# EAGLE schematic LMP2011basedV2 (EAGLE 8.5.1)
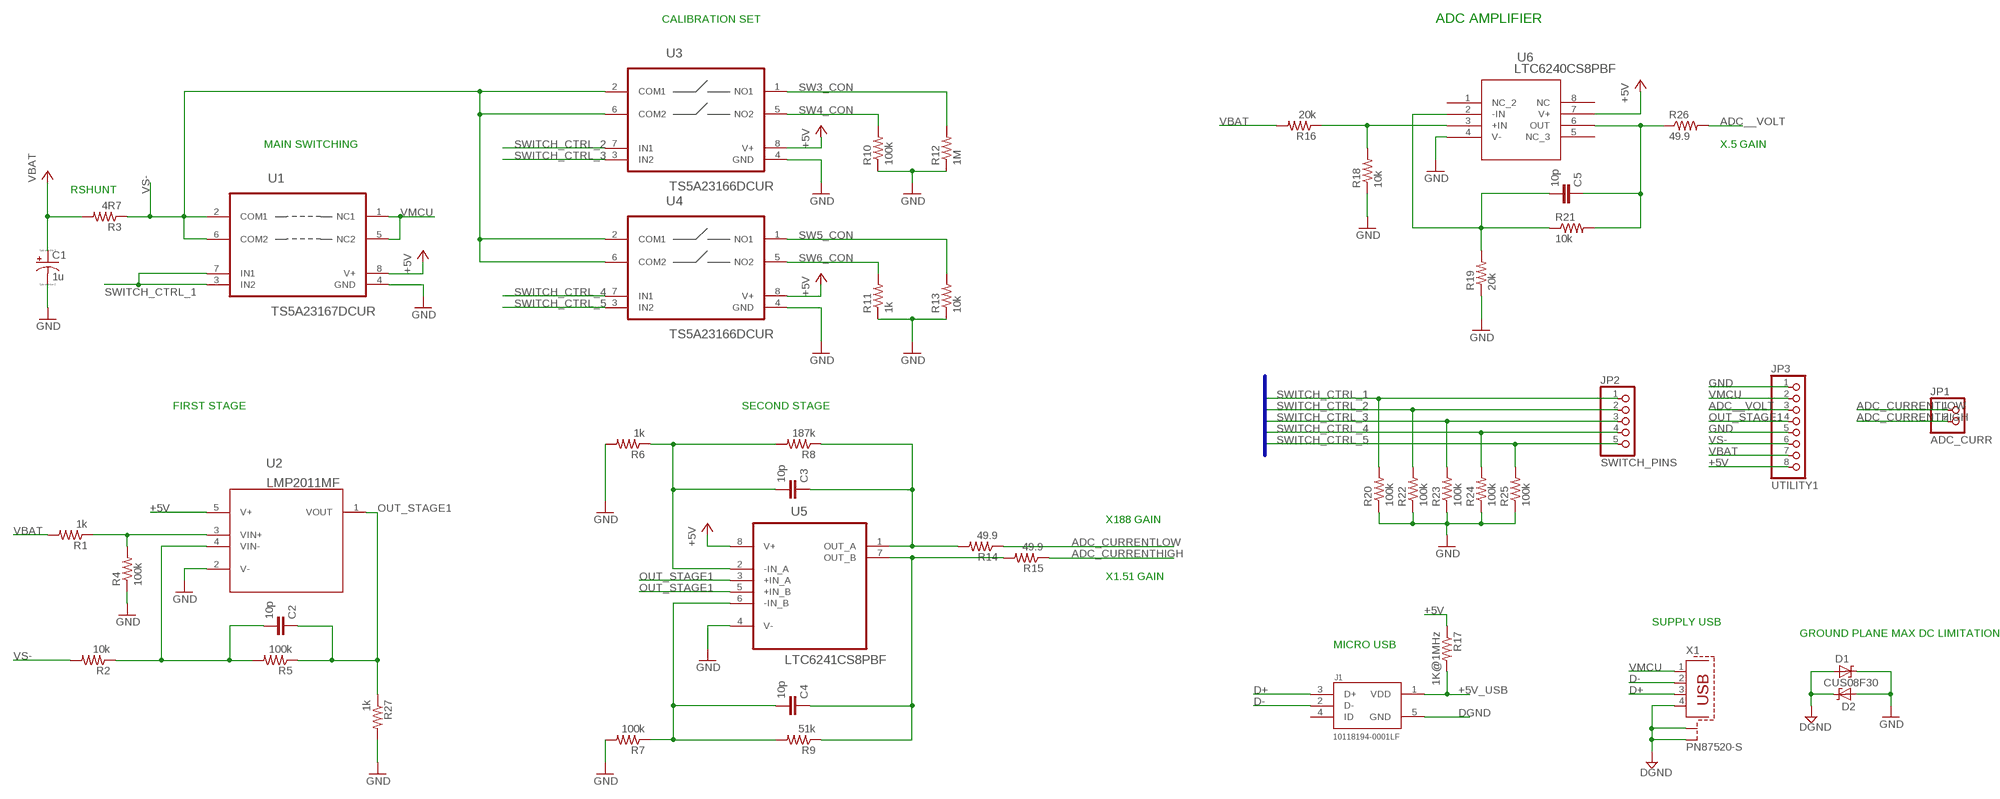
[diagram p0: schematic, sheet 1]

## Parts
C1  1u  CPOL-USB  [PANASONIC_B]
C2  10p  C-EUC0805  [C0805]
C3  10p  C-EUC0805  [C0805]
C4  10p  C-EUC0805  [C0805]
C5  10p  C-EUC0805  [C0805]
D1  CUS08F30  [SOD323]
D2  CUS08F30  [SOD323]
J1  10118194-0001LF  [FRAMATOME_10118194-0001LF]
JP1  ADC_CURR  PINHD-1X2  [1X02]
JP2  SWITCH_PINS  PINHD-1X5  [1X05]
JP3  UTILITY1  PINHD-1X8  [1X08]
R1  1k  R-US_R0805  [R0805]
R2  10k  R-US_R0805  [R0805]
R3  4R7  R-US_R0805  [R0805]
R4  100k  R-US_R0805  [R0805]
R5  100k  R-US_R0805  [R0805]
R6  1k  R-US_R0805  [R0805]
R7  100k  R-US_R0805  [R0805]
R8  187k  R-US_R0805  [R0805]
R9  51k  R-US_R0805  [R0805]
R10  100k  R-US_R0805  [R0805]
R11  1k  R-US_R0805  [R0805]
R12  1M  R-US_R0805  [R0805]
R13  10k  R-US_R0805  [R0805]
R14  49.9  R-US_R0805  [R0805]
R15  49.9  R-US_R0805  [R0805]
R16  20k  R-US_R0805  [R0805]
R17  1K@1MHz  R-US_R0805  [R0805]
R18  10k  R-US_R0805  [R0805]
R19  20k  R-US_R0805  [R0805]
R20  100k  R-US_R0805  [R0805]
R21  10k  R-US_R0805  [R0805]
R22  100k  R-US_R0805  [R0805]
R23  100k  R-US_R0805  [R0805]
R24  100k  R-US_R0805  [R0805]
R25  100k  R-US_R0805  [R0805]
R26  49.9  R-US_R0603  [R0603]
R27  1k  R-US_R0805  [R0805]
U1  TS5A23167DCUR  [SOP50P310X90-8N]
U2  LMP2011MF  [SOT95P285X120-5N]
U3  TS5A23166DCUR  [SOP50P310X90-8N]
U4  TS5A23166DCUR  [SOP50P310X90-8N]
U5  LTC6241CS8PBF  [SOIC127P600X175-8N]
U6  LTC6240CS8PBF  [SO-8_S]
X1  PN87520-S  [PN87520-S]

## Nets
+5V: JP3.8 R17.1 U1.8(V+) U2.5(V+) U3.8(V+) U4.8(V+) U5.8(V+) U6.7(V+)
+5V_USB: J1.1(VDD) R17.2
ADC__VOLT: JP3.3 R26.2
ADC_CURRENTHIGH: JP1.2 R15.1
ADC_CURRENTLOW: JP1.1 R14.1
D+: J1.3(D+) X1.3
D-: J1.2(D-) X1.2
DGND: D1.A D2.C J1.5(GND) X1.4 X1.S1 X1.S2
GND: C1.- D1.C D2.A JP3.1 JP3.5 R4.1 R6.2 R7.2 R10.1 R11.1 R12.1 R13.1 R18.1 R19.1 R20.1 R22.1 R23.1 R24.1 R25.1 R27.2 U1.4(GND) U2.2(V-) U3.4(GND) U4.4(GND) U5.4(V-) U6.4(V-)
N$1: R16.1 R18.2 U6.3(+IN)
N$2: C5.1 R21.2 R26.1 U6.6(OUT)
N$4: C5.2 R19.2 R21.1 U6.2(-IN)
N$7: C3.1 R8.1 R14.2 U5.1(OUT_A)
N$10: C2.2 R2.1 R5.2 U2.4(VIN-)
N$11: C4.1 R9.1 R15.2 U5.7(OUT_B)
N$12: R1.1 R4.2 U2.3(VIN+)
N$13: C3.2 R6.1 R8.2 U5.2(-IN_A)
N$15: C4.2 R7.1 R9.2 U5.6(-IN_B)
OUT_STAGE1: C2.1 JP3.4 R5.1 R27.1 U2.1(VOUT) U5.3(+IN_A) U5.5(+IN_B)
SW3_CON: R12.2 U3.1(NO1)
SW4_CON: R10.2 U3.5(NO2)
SW5_CON: R13.2 U4.1(NO1)
SW6_CON: R11.2 U4.5(NO2)
SWITCH_CTRL_1: JP2.1 R20.2 U1.3(IN2) U1.7(IN1)
SWITCH_CTRL_2: JP2.2 R22.2 U3.7(IN1)
SWITCH_CTRL_3: JP2.3 R23.2 U3.3(IN2)
SWITCH_CTRL_4: JP2.4 R24.2 U4.7(IN1)
SWITCH_CTRL_5: JP2.5 R25.2 U4.3(IN2)
VBAT: C1.+ JP3.7 R1.2 R3.2 R16.2
VMCU: JP3.2 U1.1(NC1) U1.5(NC2) X1.1
VS-: JP3.6 R2.2 R3.1 U1.2(COM1) U1.6(COM2) U3.2(COM1) U3.6(COM2) U4.2(COM1) U4.6(COM2)
Unconnected: J1.4(ID) U6.1(NC_2) U6.5(NC_3) U6.8(NC)

## Buses
SWITCH_CTRL_[1..6]

## Notes on the sheet
- CALIBRATION SET | ADC AMPLIFIER
- MAIN SWITCHING | X.5 GAIN
- RSHUNT
- FIRST STAGE | SECOND STAGE
- X188 GAIN
- X1.51 GAIN
- SUPPLY USB
- GROUND PLANE MAX DC LIMITATION
- MICRO USB

## Library data of the parts
C1 = resistor:CPOL-US: POLARIZED CAPACITOR, American symbol
C2-C5 = resistor:C-EU: CAPACITOR, European symbol
D1 D2 = CUS08F30:CUS08F30: http://octopart.com/1n4148ws-v-gs08-vishay+semiconductor-40871699; DESCRIPTION: DIODE SCHOTTKY 30V 800MA USC, 220mV @ 10mA, SOD-23 OR SC-76; MF: TOSHIBA; MP: CUS08F30; PACKAGE: SOD-323 Vishay Semiconductor; PRICE: None
J1 = 10118194-0001LF:10118194-0001LF: Conn Micro USB Type B RCP 5 POS 0.65mm Solder RA SMD 5 Terminal 1 Port T/R; AVAILABILITY: Good; DESCRIPTION: Conn Micro USB Type B RCP 5 POS 0.65mm Solder RA SMD 5 Terminal 1 Port T/R; MF: Amphenol; MP: 10118194-0001LF; PACKAGE: DIP-4 FCI; PRICE: 0.24 USD
JP1 = pinhead:PINHD-1X2: PIN HEADER
JP2 = pinhead:PINHD-1X5: PIN HEADER
JP3 = pinhead:PINHD-1X8: PIN HEADER
R1-R27 = resistor:R-US_: RESISTOR, American symbol
U1 = TS5A2316XDCUR:TS5A23167DCUR: SPST ANALOG SWITCH; AVAILABILITY: Good; DESCRIPTION: 0.9-Ohm Dual SPST Analog Switch 5-V/3.3-V 2-Channel Analog Switch 8-VSSOP -40 to 85; MF: Texas Instruments; MP: TS5A23167DCUR; PACKAGE: VFSOP-8 Texas Instruments; PRICE: 0.46 USD
U2 = LMP2011MF:LMP2011MF: Rail-to-Rail Output Operational Amplifier; DESCRIPTION: IC OPAMP GP 3MHZ RRO SOT23-5; DIGI-KEY_PART_NUMBER: LMP2011MF/NOPBCT-ND; DIGI-KEY_PURCHASE_URL: https://www.digikey.com/product-detail/es/texas-instruments/LMP2011MF-NOPB/LMP2011MF-NOPBCT-ND/723480?WT.z_cid=ref_snapeda&utm_source=snapeda&utm_medium=aggregator&utm_campaign=buynow; MF: Texas Instruments; MP: LMP2011MF/NOPB; PACKAGE: SOT-23-5 Texas Instruments
U3 U4 = TS5A2316XDCUR:TS5A23166DCUR: SPST ANALOG SWITCH; AVAILABILITY: Good; DESCRIPTION: 0.9-Ohm Dual SPST Analog Switch 5-V/3.3-V 2-Channel Analog Switch 8-VSSOP -40 to 85; MF: Texas Instruments; MP: TS5A23166DCUR; PACKAGE: VFSOP-8 Texas Instruments; PRICE: 0.46 USD
U5 = LTC6241CS8PBF:LTC6241CS8PBF: Low Noise, Rail-to-Rail Output,CMOS Op Amps; AVAILABILITY: Good; DESCRIPTION: LTC6241 - Dual 18MHz, Low Noise, Rail-to-Rail Output, CMOS Op Amp; MF: Linear Technology; MP: LTC6241CS8#PBF; PACKAGE: SO-8 Linear Technology; PRICE: 2.03 USD
U6 = LTC6240CS8PBF:LTC6240CS8PBF; AVAILABILITY: Good; DESCRIPTION: LTC6240 Op Amp CMOS R-R SOICN-8; MF: Linear Technology; MP: LTC6240CS8#PBF; PACKAGE: SOIC-8 Linear Technology; PRICE: 1.20 USD
X1 = con-berg:PN87520-S; OC_FARNELL: unknown; OC_NEWARK: unknown